# Altium project cyber60-1.PrjPcb
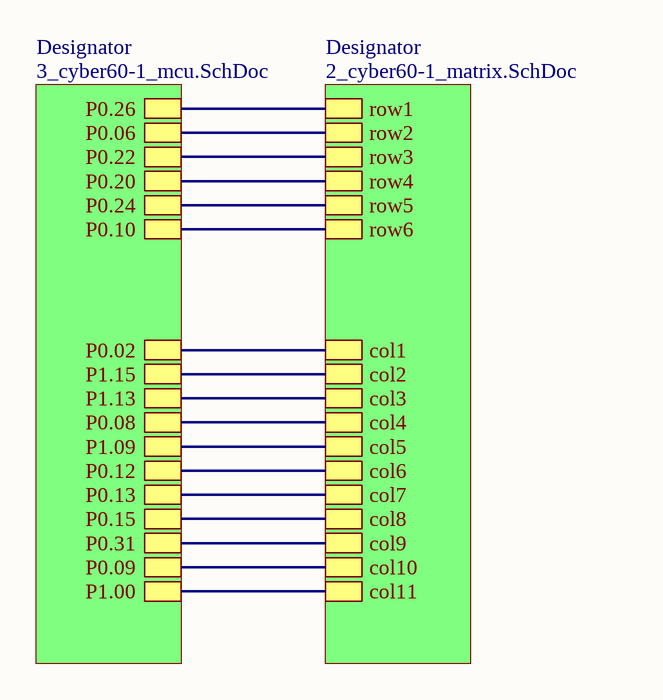
[diagram p0: 1_cyber60-1_top.SchDoc]
2 sheets, 43 parts. Net scope: hierarchical (ports join the sheet entries above them; power ports are global).
Board file: cyber60-1.PcbDoc
Sheets:
  1_cyber60-1_top.SchDoc
    Designator = 3_cyber60-1_mcu.SchDoc

## Sheet 1_cyber60-1_top.SchDoc
size A4

### Sub-sheets
Designator = 2_cyber60-1_matrix.SchDoc (file not in this document): col6, col8, col5, col7, col3, col2, col1, col4, row3, row1, row4, row2, row5, col11, col10, col9, row6
Designator = 3_cyber60-1_mcu.SchDoc: P0.24, P0.09, P1.15, P0.20, P1.00, P0.22, P1.13, P0.02, P0.10, P0.08, P0.06, P0.15, P0.13, P0.12, P1.09, P0.26, P0.31

### Nets
P0.02: sheet Designator/col1, sheet Designator/P0.02
P0.06: sheet Designator/row2, sheet Designator/P0.06
P0.08: sheet Designator/col4, sheet Designator/P0.08
P0.09: sheet Designator/col10, sheet Designator/P0.09
P0.10: sheet Designator/row6, sheet Designator/P0.10
P0.12: sheet Designator/col6, sheet Designator/P0.12
P0.13: sheet Designator/col7, sheet Designator/P0.13
P0.15: sheet Designator/col8, sheet Designator/P0.15
P0.20: sheet Designator/row4, sheet Designator/P0.20
P0.22: sheet Designator/row3, sheet Designator/P0.22
P0.24: sheet Designator/row5, sheet Designator/P0.24
P0.26: sheet Designator/row1, sheet Designator/P0.26
P0.31: sheet Designator/col9, sheet Designator/P0.31
P1.00: sheet Designator/col11, sheet Designator/P1.00
P1.09: sheet Designator/col5, sheet Designator/P1.09
P1.13: sheet Designator/col3, sheet Designator/P1.13
P1.15: sheet Designator/col2, sheet Designator/P1.15

## Sheet 3_cyber60-1_mcu.SchDoc: PCA10056 - nRF52840 MCU
size A3; Organization: Nordic Semiconductor; DocumentNumber: 2; SheetNumber: 2; SheetTotal: 7; CompanyName: Nordic Semiconductor; ProjectName: cyber60-1.PrjPcb
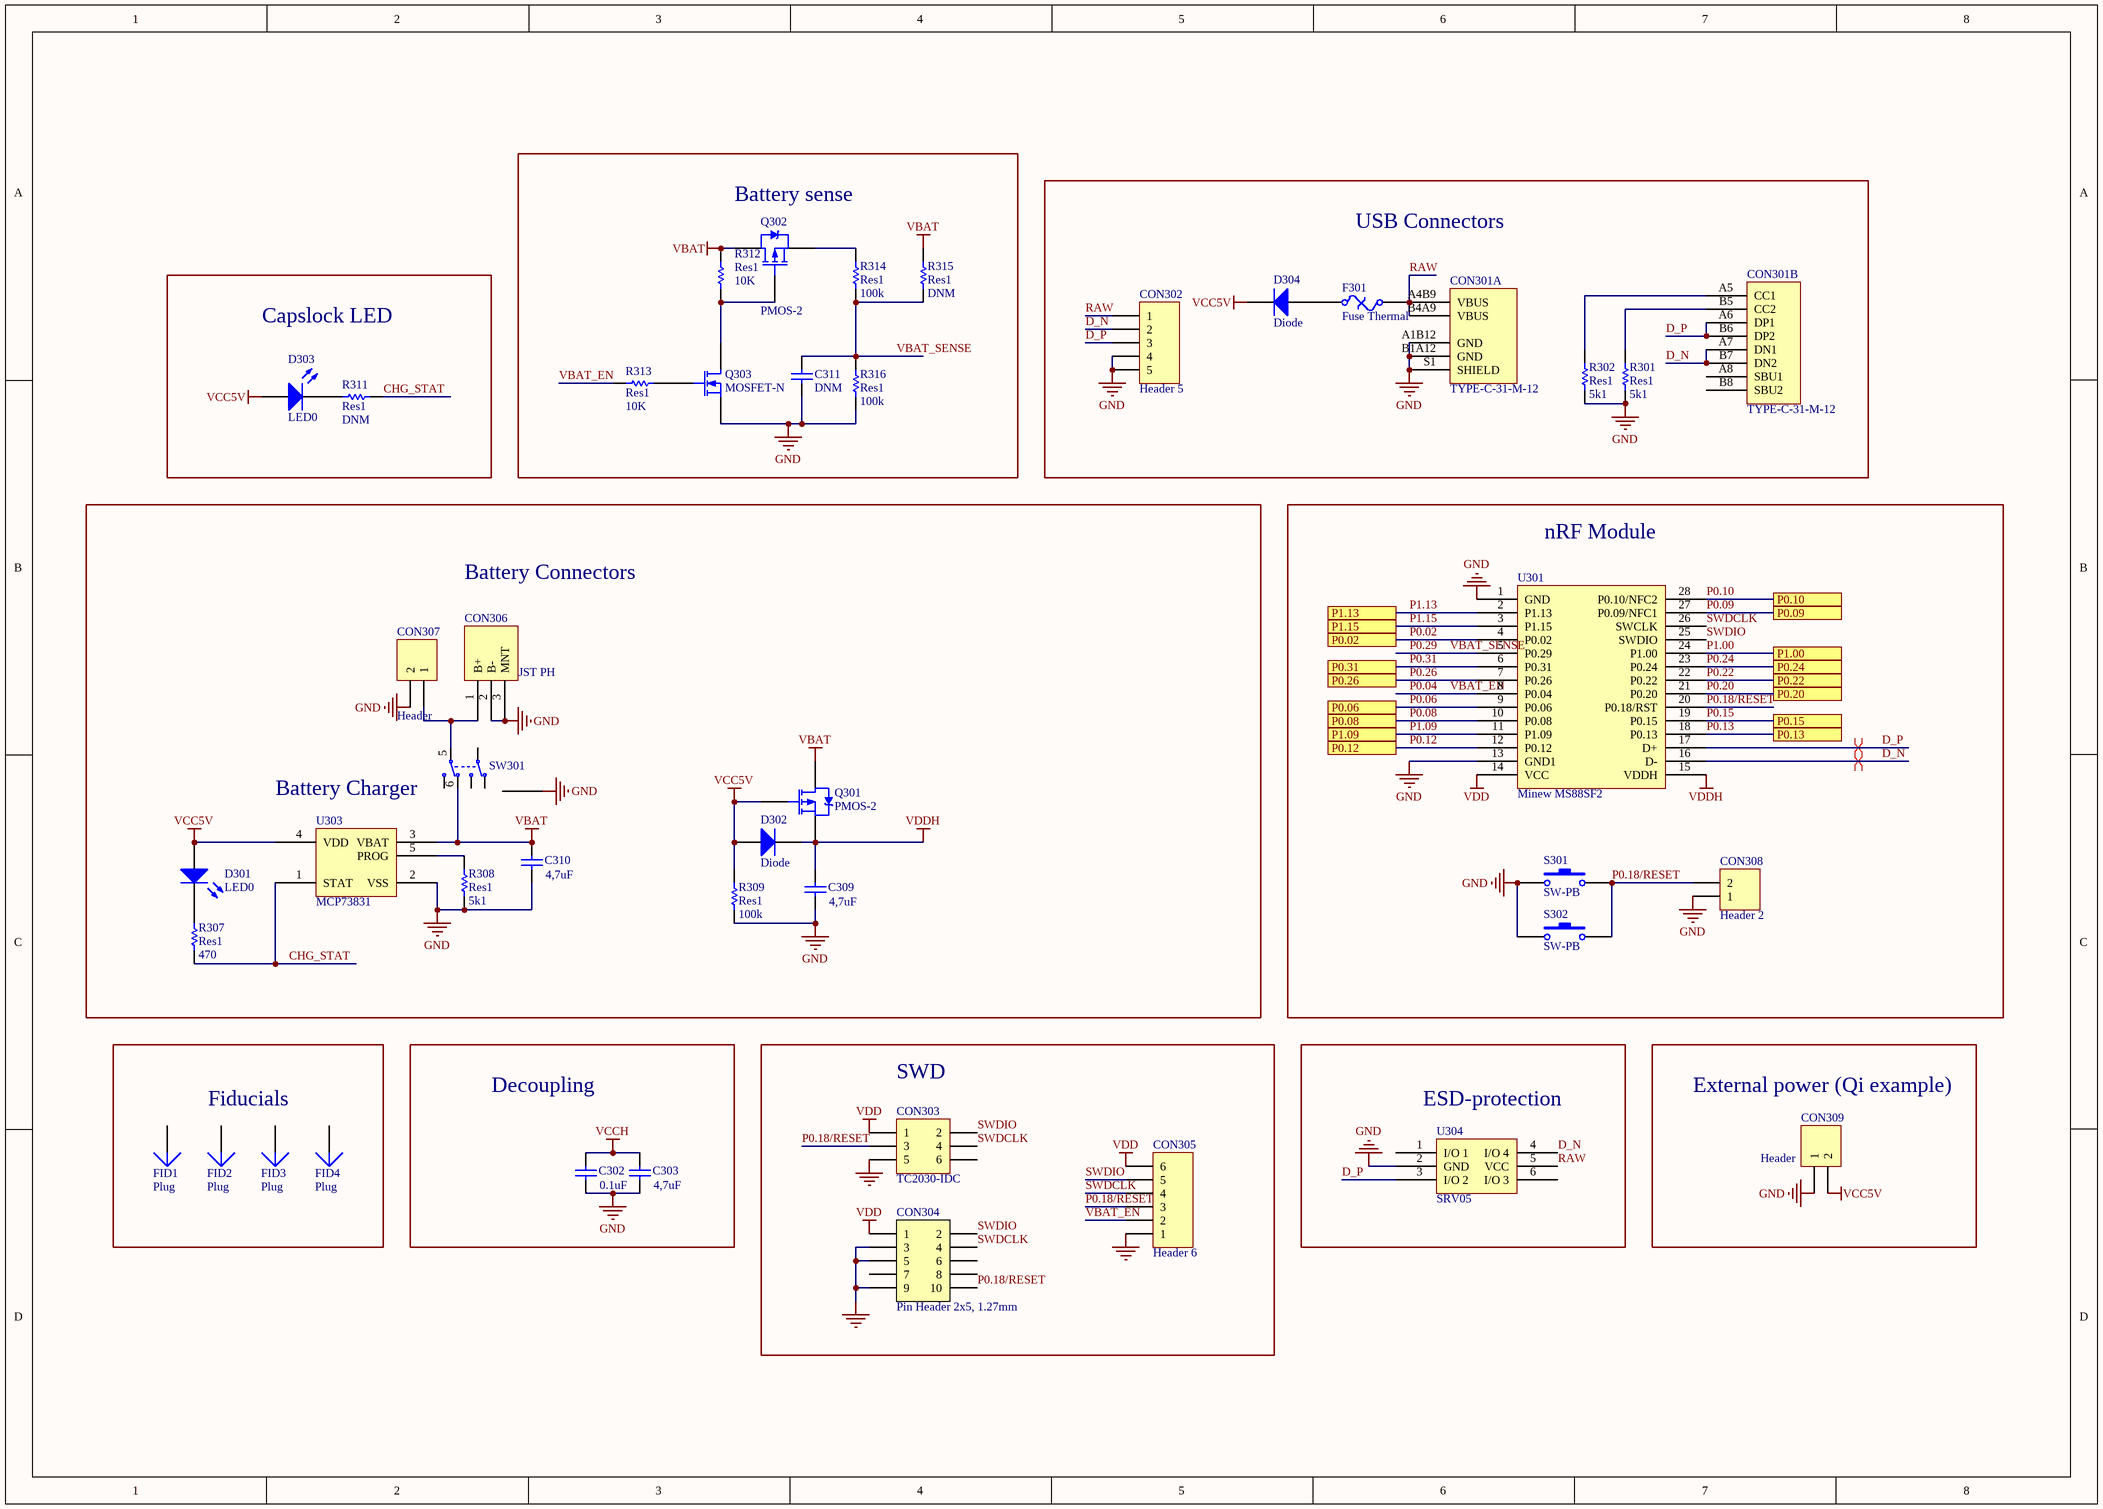
[diagram p1: 3_cyber60-1_mcu.SchDoc]

### Parts
C302  value 0.1uF  [C0603[1608]]
C303  value 4,7uF  [C0603[1608]]
C309  value 4,7uF  [C0603[1608]]
C310  value 4,7uF  [C0603[1608]]
C311  DNM  [C0603[1608]]  (no BOM)
CON301  TYPE-C-31-M-12  [TYPE-C-31-M-12]  (parts A,B of 2)
CON302  Header 5  [JST SM04B-SRSS-TB]
CON303  TC2030-IDC  [TC2030-IDC-NL]  (no BOM)
CON304  Pin Header 2x5, 1.27mm  [HDR_2x5-SMD-1.27mm-K]  (no BOM)
CON305  Header 6  [HDR1X6]  (no BOM)
CON306  JST PH  [JST SM02B-SRSS-TB]
CON307  Header  [JST S2B-PH-K(LF)(SN)]  (no BOM)
CON308  Header 2  [HDR1X2]  (no BOM)
CON309  Header  [HDR1X2]  (no BOM)
D301  LED0  [LED0603[1608]]
D302  Diode  [SOD-123]
D303  LED0  [MX-switch - CAPS - LED NO SWITCH]
D304  Diode  [SOD-123]
F301  Fuse Thermal  [C1206[3216]]
FID1  Plug  [Fiducial_Nordic]  (no BOM)
FID2  Plug  [Fiducial_Nordic]  (no BOM)
FID3  Plug  [Fiducial_Nordic]  (no BOM)
FID4  Plug  [Fiducial_Nordic]  (no BOM)
Q301  PMOS-2  [SOT-23-3]
Q302  PMOS-2  [SOT-23-3]
Q303  MOSFET-N  [SOT-23-3]
R301  Res1  value 5k1  [R0603[1608]]
R302  Res1  value 5k1  [R0603[1608]]
R307  Res1  value 470  [R0603[1608]]
R308  Res1  value 5k1  [R0603[1608]]
R309  Res1  value 100k  [R0603[1608]]
R311  Res1  value DNM  [R0603[1608]]  (no BOM)
R312  Res1  value 10K  [R0603[1608]]
R313  Res1  value 10K  [R0603[1608]]
R314  Res1  value 100k  [R0603[1608]]
R315  Res1  value DNM  [R0603[1608]]  (no BOM)
R316  Res1  value 100k  [R0603[1608]]
S301  SW-PB  [Combo switch]
S302  SW-PB  [Combo switch]
SW301  (no value)  [AlpsAlpine SSSS820201]
U301  Minew MS88SF2  [Minew MS88SF2]
U303  MCP73831  [SOT-23-5]
U304  SRV05  [SOT-23-6]

### Blocks framed on the sheet
Battery sense: C311 Q302 Q303 R312-R316
USB Connectors: CON301 CON302 D304 F301 R301 R302
Capslock LED: D303 R311
nRF Module: CON308 S301 S302 U301
Fiducials: FID1-FID4
Decoupling: C302 C303
SWD: CON303-CON305
ESD-protection: U304
External power (Qi example): CON309

### Ports
P0.02, P0.06, P0.08, P0.09, P0.10, P0.12, P0.13, P0.15, P0.20, P0.22, P0.24, P0.26, P0.31, P1.00, P1.09, P1.13, P1.15

### Nets
GND: C302.1 C303.1 C309.1 C310.1 C311.1 CON301.A1B12(GND) CON301.B1A12(GND) CON301.S1(SHIELD) CON302.4 CON302.5 CON303.5 CON304.3 CON304.5 CON304.9 CON305.1 CON306.2(B-) CON306.3(MNT) CON307.2 CON308.1 CON309.1 Q303.2(S) R301.2 R302.2 R308.2 R309.2 R316.2 S301.1 S302.2 SW301.7(MNT) U301.1(GND) U301.13(GND1) U303.2(VSS) U304.2(GND)
VBAT: C310.2 Q301.3(D) Q302.3(D) R312.1 R315.2 SW301.6(N.C-2) U303.3(VBAT)
VCC5V: CON309.2 D301.1(A) D302.1(A) D303.1(A) D304.2(K) Q301.1(G) R309.1 U303.4(VDD)
VCCH: C302.2 C303.2
VDD: CON303.1 CON304.1 CON305.6 U301.14(VCC)
VDDH: C309.2 D302.2(K) Q301.2(S) U301.15(VDDH)
CHG_STAT: R307.1 R311.1 U303.1(STAT)
D_N: CON301.A7(DN1) CON301.B7(DN2) CON302.2 U301.16(D-) U304.4(I/O_4)
D_P: CON301.A6(DP1) CON301.B6(DP2) CON302.3 U301.17(D+) U304.3(I/O_2)
P0.02: U301.4(P0.02) ; port P0.02
P0.04: CON305.2 R313.1 U301.8(P0.04)  [also labelled VBAT_EN]
P0.06: U301.9(P0.06) ; port P0.06
P0.08: U301.10(P0.08) ; port P0.08
P0.09: U301.27(P0.09/NFC1) ; port P0.09
P0.10: U301.28(P0.10/NFC2) ; port P0.10
P0.12: U301.12(P0.12) ; port P0.12
P0.13: U301.18(P0.13) ; port P0.13
P0.15: U301.19(P0.15) ; port P0.15
P0.18/RESET: CON303.3 CON304.10 CON305.3 CON308.2 S301.2 S302.1 U301.20(P0.18/RST)
P0.20: U301.21(P0.20) ; port P0.20
P0.22: U301.22(P0.22) ; port P0.22
P0.24: U301.23(P0.24) ; port P0.24
P0.26: U301.7(P0.26) ; port P0.26
P0.29: C311.2 R314.2 R315.1 R316.1 U301.5(P0.29)  [also labelled VBAT_SENSE]
P0.31: U301.6(P0.31) ; port P0.31
P1.00: U301.24(P1.00) ; port P1.00
P1.09: U301.11(P1.09) ; port P1.09
P1.13: U301.2(P1.13) ; port P1.13
P1.15: U301.3(P1.15) ; port P1.15
RAW: CON301.A4B9(VBUS) CON301.B4A9(VBUS) CON302.1 F301.2 U304.5(VCC)
SWDCLK: CON303.4 CON304.4 CON305.4 U301.26(SWCLK)
SWDIO: CON303.2 CON304.2 CON305.5 U301.25(SWDIO)
NetCON301_A5: CON301.A5(CC1) R302.1
NetCON301_B5: CON301.B5(CC2) R301.1
NetCON306_1: CON306.1(B+) CON307.1 SW301.5(COM-2)
NetD301_2: D301.2(K) R307.2
NetD303_2: D303.2(K) R311.2
NetD304_1: D304.1(A) F301.1
NetQ302_1: Q302.1(G) Q303.3(D) R312.2
NetQ302_2: Q302.2(S) R314.1
NetQ303_1: Q303.1(G) R313.2
NetR308_1: R308.1 U303.5(PROG)

Not connected (* = marked no-connect by the designer): CON301 A8(SBU1) B8(SBU2); CON303 6; CON304 6 7 8; FID1 1; FID2 1; FID3 1; FID4 1; SW301 1(N.O-1) 2(COM-1) 3(N.C-1) 4(N.O-2); U304 1(I/O_1) 6(I/O_3)

### Layout directives
differential pair: D_N, D_P

### Notes on the sheet
- Battery Connectors
- (near SW301) Battery Charger

### Library data of the parts
C302 = Cap: Capacitor; MRF.Part: CC0603KRX7R9BB104; MFG: KEMET; MFGPN: C0603C104M5RACTU; LCSC MFG: YAGEO; Version: 0603 imperial; LCSC Part #: C14663
C303 C309 C310 = Cap: Capacitor; MRF.Part: CL10A475KO8NNNC; LCSC MFG: Samsung Electro-Mechanics; LCSC Part #: C19666
C311 = Cap: Capacitor; Version: 0603 imperial
CON301 = TYPE-C-31-M-12: MFG: Korean Hroparts Elec; MFGPN: TYPE-C-31-M-12
CON302 = Header 5: Header, 5-Pin; MFGPN: SM04B-SRSS-TB(LF)(SN); MFG: JST Sales America Inc.; LCSC MFG: JST Sales America; MRF.Part: SM04B-SRSS-TB(LF)(SN)
CON303 = Header 3X2: Header, 3-Pin, Dual row
CON304 = Pin Header 2x5 SMD, 1.27mm, KS: Pin Header 2x5, 1.27mm (50mil), SMD, Keying Shroud; MFG: Samtec Inc.; MFGPN: FTSH-105-01-F-DV-K-TR; Value: Pin Header 2x5, 1.27mm
CON305 = Header 6: Header, 6-Pin; LatestRevisionDate: 17-Jul-2002; LatestRevisionNote: Re-released for DXP Platform.; Publisher: Altium Limited
CON306 = JST S2B-PH-SM4-TB: MRF.Part: SM02B-SRSS-TB(LF)(SN); LCSC MFG: JST Sales America; LCSC Part #: C160402
CON307 = Header 2: Header, 2-Pin; MRF.Part: S2B-PH-K(LF)(SN); LCSC MFG: JST Sales America; LCSC Part #: C265016
CON308 CON309 = Header 2: Header, 2-Pin
D301 = LED0: Typical INFRARED GaAs LED; MRF.Part: 19-213/Y2C-CQ2R2L/3T(CY); LCSC MFG: Everlight Elec; LCSC Part #: C72038
D302 D304 = Diode: Default Diode; MRF.Part: B5819W; LCSC MFG: Changjiang Electronics Tech (CJ); Version: SOD-123; LCSC Part #: C8598
D303 = LED0: Typical INFRARED GaAs LED; MFGPN: AM2520SECK09; MFG: Kingbright
F301 = Fuse Thermal: Thermal Fuse; MRF.Part: ASMD1206-050; MFG: Bel Fuse Inc.; MFGPN: 0ZCJ0050FF2G; LCSC MFG: Shenzhen JDT Fuse; LCSC Part #: C135338
Q301 Q302 = PMOS-2: P-Channel Power MOSFET; MRF.Part: SI2301CDS-T1-GE3; Note: Pin 4 not drawn and electrically connected to Pin 2.; LCSC MFG: Vishay Intertech; LCSC Part #: C10487
Q303 = MOSFET-N: N-Channel MOSFET; MRF.Part: 2N7002; LCSC MFG: Changjiang Electronics Tech (CJ); LCSC Part #: C8545
R301 R302 R308 = Res1: Resistor; MRF.Part: 0603WAF5101T5E; MFG: Panasonic Electronic Components; MFGPN: ERJ-3EKF5101V; LCSC MFG: Uniroyal Elec; Version: 0603 imperial; LCSC Part #: C23186
R307 = Res1: Resistor; MRF.Part: 0603WAF4700T5E; MFG: Panasonic Electronic Components; MFGPN: ERJ-3EKF5101V; LCSC MFG: UNI-ROYAL(Uniroyal Elec); Version: 0603 imperial; LCSC Part #: C23179
R309 R314 R316 = Res1: Resistor; MRF.Part: 0603WAF1003T5E; LCSC MFG: Uniroyal Elec; Version: 0603 imperial; LCSC Part #: C25803
R311 = Res1: Resistor
R312 R313 = Res1: Resistor; MRF.Part: 0603WAF1002T5E; MFG: Panasonic Electronic Components; MFGPN: ERJ-3EKF5101V; LCSC MFG: Uniroyal Elec; Version: 0603 imperial; LCSC Part #: C25804
R315 = Res1: Resistor; MFG: TE Connectivity Passive Product; MFGPN: CRGCQ0603F150R; Version: 0603 imperial
S301 S302 = SW-PB: Switch; MRF.Part: TS-1187A-C-D-B; MFGPN: PTS645SM43SMTR92 LFS; MFG: C&K; LCSC MFG: XKB Enterprise; LCSC Part #: C318888
SW301 = MKH-22D14-G2-B: Slide Switch DPDT; MRF.Part: SSSS820201; LCSC MFG: ALPS Electric; LCSC Part #: C160879
U303 = MCP73831: MRF.Part: TP4054; LCSC MFG: Nanjing Extension Microelectronics; LCSC Part #: C32574
U304 = SRV05: MRF.Part: SRV05-4-P-T7; LCSC MFG: ProTek Devices; LCSC Part #: C85364
U301 = Minew MS88SF2: MFG: Minew; MFGPN: MS88SF2